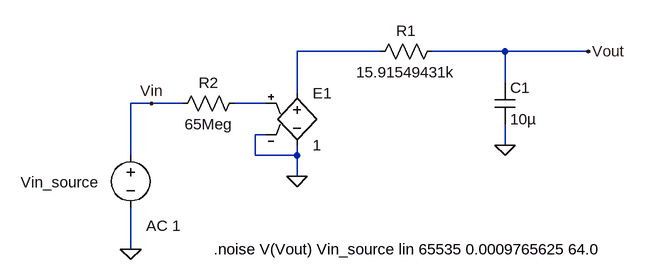
[diagram p0: schematic validate_integrate_psd.asc]
validate_integrate_psd.asc, the LTspice schematic file:
Version 4
SHEET 1 2236 752
WIRE 272 -224 144 -224
WIRE 464 -224 352 -224
WIRE 592 -224 464 -224
WIRE 464 -176 464 -224
WIRE 144 -160 144 -224
WIRE -80 -144 -112 -144
WIRE -32 -144 -80 -144
WIRE 96 -144 48 -144
WIRE 96 -96 80 -96
WIRE 464 -80 464 -112
WIRE -112 -64 -112 -144
WIRE 80 -64 80 -96
WIRE 144 -64 144 -80
WIRE 144 -64 80 -64
WIRE 144 -32 144 -64
WIRE -112 80 -112 16
FLAG -112 80 0
FLAG -80 -144 Vin
FLAG 592 -224 Vout
FLAG 464 -80 0
FLAG 144 -32 0
SYMBOL voltage -112 -80 R0
WINDOW 123 24 124 Left 2
WINDOW 39 0 0 Left 2
WINDOW 0 -169 57 Left 2
SYMATTR Value2 AC 1
SYMATTR InstName Vin_source
SYMATTR Value ""
SYMBOL res 368 -240 R90
WINDOW 0 0 56 VBottom 2
WINDOW 3 32 56 VTop 2
SYMATTR InstName R1
SYMATTR Value 15.91549431k
SYMBOL cap 448 -176 R0
SYMATTR InstName C1
SYMATTR Value 10µ
SYMBOL res 64 -160 R90
WINDOW 0 0 56 VBottom 2
WINDOW 3 32 56 VTop 2
SYMATTR InstName R2
SYMATTR Value 65Meg
SYMBOL e 144 -176 R0
SYMATTR InstName E1
SYMATTR Value 1
TEXT 16 80 Left 2 !.noise V(Vout) Vin_source lin 65535 0.0009765625 64.0

The netlist it stands for:
* validate_integrate_psd.asc
Vin_source Vin 0 AC 1
R1 Vout N001 15.91549431k
C1 Vout 0 10µ
R2 N002 Vin 65Meg
E1 N001 0 N002 0 1
.noise V(Vout) Vin_source lin 65535 0.0009765625 64.0
.backanno
.end